# Altium schematic sheet POW_CONT.SchDoc
size A
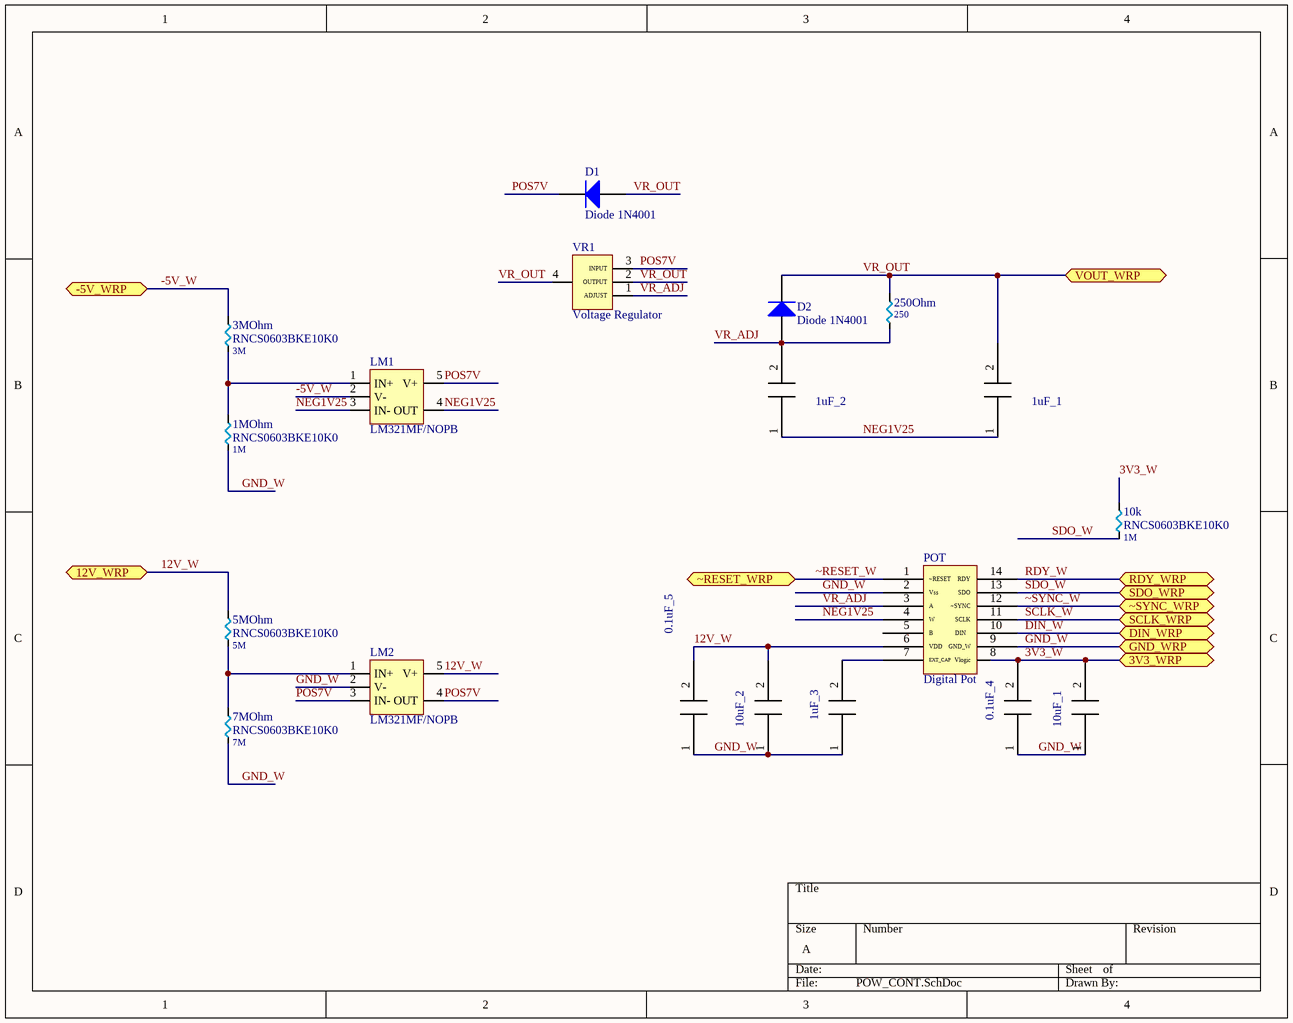
[diagram p0: POW_CONT.SchDoc]

## Parts
0.1uF_4  0.1uF_0603  [0.1uF_0603]  (value not drawn)
0.1uF_5  0.1uF_0603  [0.1uF_0603]  (value not drawn)
1MOhm  RNCS0603BKE10K0  Resistance (Ohms): 1M  [0.1uF_0603]
1uF_1  0.1uF_0603  [0.1uF_0603]  (value not drawn)
1uF_2  0.1uF_0603  [0.1uF_0603]  (value not drawn)
1uF_3  0.1uF_0603  [0.1uF_0603]  (value not drawn)
3MOhm  RNCS0603BKE10K0  Resistance (Ohms): 3M  [0.1uF_0603]
5MOhm  RNCS0603BKE10K0  Resistance (Ohms): 5M  [0.1uF_0603]
7MOhm  RNCS0603BKE10K0  Resistance (Ohms): 7M  [0.1uF_0603]
10k  RNCS0603BKE10K0  Resistance (Ohms): 1M  [0.1uF_0603]
10uF_1  0.1uF_0603  [0.1uF_0603]  (value not drawn)
10uF_2  0.1uF_0603  [0.1uF_0603]  (value not drawn)
250Ohm  Resistance (Ohms): 250  [0.1uF_0603]  (hidden comment: RNCS0603BKE10K0)
D1  Diode 1N4001  [DO-41]
D2  Diode 1N4001  [DO-41]
LM1  LM321MF/NOPB  [op_amp]
LM2  LM321MF/NOPB  [op_amp]
POT  Digital Pot  [Dig_Pot]
VR1  Voltage Regulator  [volt_reg]

## Ports
3V3_WRP, 12V_WRP, -5V_WRP, DIN_WRP, GND_WRP, RDY_WRP, SCLK_WRP, SDO_WRP, VOUT_WRP, ~RESET_WRP, ~SYNC_WRP

## Nets
3V3_W: 0.1uF_4.2 10k.2 10uF_1.2 POT.8(Vlogic) ; port 3V3_WRP
12V_W: 0.1uF_5.2 5MOhm.2 10uF_2.2 LM2.5(V+) POT.6(VDD) ; port 12V_WRP
-5V_W: 3MOhm.2 LM1.2(V-) ; port -5V_WRP
DIN_W: POT.10(DIN) ; port DIN_WRP
GND_W: 0.1uF_4.1 0.1uF_5.1 1MOhm.1 1uF_3.1 7MOhm.1 10uF_1.1 10uF_2.1 LM2.2(V-) POT.2(Vss) POT.9(GND_W) ; port GND_WRP
NEG1V25: 1uF_1.1 1uF_2.1 LM1.3(IN-) LM1.4(OUT) POT.4(W)
POS7V: D1.2(K) LM1.5(V+) LM2.3(IN-) LM2.4(OUT) VR1.3(INPUT)
RDY_W: POT.14(RDY) ; port RDY_WRP
SCLK_W: POT.11(SCLK) ; port SCLK_WRP
SDO_W: 10k.1 POT.13(SDO) ; port SDO_WRP
VR_ADJ: 1uF_2.2 250Ohm.1 D2.1(A) POT.3(A) VR1.1(ADJUST)
VR_OUT: 1uF_1.2 250Ohm.2 D1.1(A) D2.2(K) VR1.2(OUTPUT) VR1.4(Output) ; port VOUT_WRP
~RESET_W: POT.1(~RESET) ; port ~RESET_WRP
~SYNC_W: POT.12(~SYNC) ; port ~SYNC_WRP
Net1MOhm_2: 1MOhm.2 3MOhm.1 LM1.1(IN+)
Net1uF_3_2: 1uF_3.2 POT.7(EXT_CAP)
Net5MOhm_1: 5MOhm.1 7MOhm.2 LM2.1(IN+)

Not connected (* = marked no-connect by the designer): POT 5(B)

## Library data of the parts
1MOhm 3MOhm 5MOhm 7MOhm 10k 250Ohm = RNCS0603BKE10K0: RES 10K OHM 1/16W 0.1% 0603; Manufacturer: Stackpole Electronics Inc; Power (Watts): 0.063W, 1/16W; Temperature Coefficient: ±25ppm/°C; Supplier 1: Digi-Key; Manufacturer Part Number: RNCS0603BKE10K0; RoHS: RoHS Compliant; Category: Resistors; Stock 1: 32000; Pricing 1: 1000=0.08, 2000=0.075, 5000=0.0675, 10000=0.066, 25000=0.06375, 50000=0.0625, 100000=0.0619 (USD); Packaging: Tape & Reel (TR); Tolerance: ±0.1%; Composition: Thin Film; Features: Anti-Corrosive, Moisture Resistant; Package / Case: 0603 (1608 Metric); Supplier Device Package: 0603; Size / Dimension: 0.061" L x 0.031" W (1.55mm x 0.80mm); Height: 0.022" (0.55mm); Number of Terminations: 2; ComponentLink1URL: http://www.seielect.com/catalog/SEI-RNCS.pdf; ComponentLink1Description: http://www.seielect.com/catalog/SEI-RNCS.pdf; Supplier Part Number 1: RNCS0603BKE10K0TR-ND
D1 D2 = Diode 1N4001: 1 Amp General Purpose Rectifier; Published: 8-Jun-2000; LatestRevisionDate: 17-Jul-2002; LatestRevisionNote: Re-released for DXP Platform.; DatasheetVersion: 1998; PackageVersion: Aug-1999; PackageReference: DO-41; Publisher: Altium Limited; PackageDescription: Diode, Axial; Body 5.2 x 2.7 mm (LxDia. max), Lead Dia. 0.86 mm (max); Code_JEDEC: DO-204-AL; ComponentLink1Description: Manufacturer Link; ComponentLink1URL: http://www.fairchildsemi.com/; ComponentLink2Description: Datasheet; ComponentLink2URL: http://www.fairchildsemi.com/ds/1N%2F1N4001.pdf
LM1 LM2 = LM321MF/NOPB: IC OPAMP GP 1MHZ SOT23-5; Manufacturer: Texas Instruments; Amplifier Type: General Purpose; Number of Circuits: 1; Slew Rate: 0.4 V/µs; Current - Input Bias: 45nA; Voltage - Input Offset: 2mV; Current - Supply: 660µA; Current - Output / Channel: 40mA; Voltage - Supply, Single/Dual (±): 3 V ~ 30 V, ±1.5 V ~ 15 V; Supplier 1: Digi-Key; Manufacturer Part Number: LM321MF/NOPB; RoHS: RoHS Compliant; Category: Integrated Circuits (ICs); Stock 1: 14679; Pricing 1: 1=0.67, 10=0.573, 100=0.4277, 500=0.33596 (USD); Packaging: Cut Tape (CT); Output Type: -; Gain Bandwidth Product: 1MHz; -3db Bandwidth: -; Operating Temperature: -40°C ~ 85°C; Mounting Type: Surface Mount; Package / Case: SC-74A, SOT-753; Supplier Device Package: SOT-23-5; ComponentLink1URL: http://www.ti.com/lit/ds/symlink/lm321.pdf; ComponentLink1Description: http://www.ti.com/lit/ds/symlink/lm321.pdf; Supplier Part Number 1: LM321MF/NOPBCT-ND
POT = Digital Pot: IC DGTL POT 1024POS 20K 14TSSOP; Manufacturer: Analog Devices Inc.; Manufacturer Part Number: AD5293BRUZ-20; Configuration: Potentiometer; Number of Circuits: 1; Number of Taps: 1024; Interface: SPI; Memory Type: Volatile; Voltage - Supply: 9 V ~ 33 V, ±9 V ~ 16.5 V; Tolerance: ±7%; Temperature Coefficient (Typ): 35 ppm/°C; Resistance - Wiper (Ohms) (Typ): 60; Supplier 1: Digi-Key; RoHS: RoHS Compliant; Category: Integrated Circuits (ICs); Stock 1: 271; Pricing 1: 1=6.13, 96=5.27771, 192=4.5826, 576=3.99047, 1056=3.47558, 2592=3.34685, 5000=3.252 (USD); Packaging: Tube; Taper: Linear; Resistance (Ohms): 20k; Features: -; Operating Temperature: -40°C ~ 105°C; Package / Case: 14-TSSOP (0.173", 4.40mm Width); Supplier Device Package: 14-TSSOP; ComponentLink1URL: http://www.analog.com/media/en/technical-documentation/data-sheets/AD5293.pdf; ComponentLink1Description: http://www.analog.com/media/en/technical-documentation/data-sheets/AD5293.pdf; Supplier Part Number 1: AD5293BRUZ-20-ND
VR1 = Voltage Regulator: IC REG LDO ADJ 1.5A DDPAK; Manufacturer: Texas Instruments; Manufacturer Part Number: LM317KTTR; Regulator Topology: Positive Adjustable; Voltage - Output: 1.25 V ~ 37 V; Number of Regulators: 1; Voltage - Input: 4.2 V ~ 40 V; Supplier 1: Digi-Key; RoHS: RoHS Compliant; Category: Integrated Circuits (ICs); Stock 1: 23750; Pricing 1: 1=0.93, 10=0.816, 100=0.624 (USD); Packaging: Cut Tape (CT); Current - Output: 1.5A; Voltage - Dropout (Typical): -; Current - Limit (Min): -; Operating Temperature: 0°C ~ 125°C; Mounting Type: Surface Mount; Package / Case: TO-263-4, D²Pak (3 Leads + Tab), TO-263AA; Supplier Device Package: DDPAK/TO-263-3; ComponentLink1URL: http://www.ti.com/lit/ds/symlink/lm317.pdf; ComponentLink1Description: http://www.ti.com/lit/ds/symlink/lm317.pdf; Supplier Part Number 1: 296-21390-1-ND